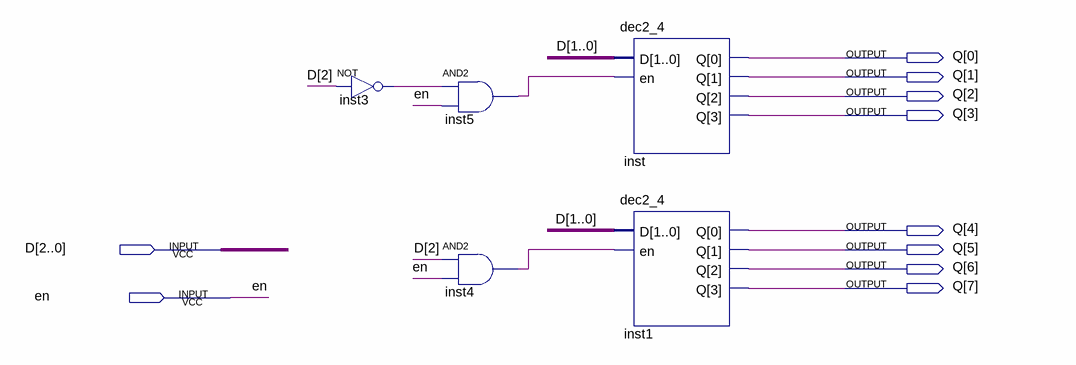
[diagram p0: schematic sheet]
// Quartus schematic dec3_8.bdf as structural Verilog: 5 symbols, 10 pins
module dec3_8 (
  input  [2:0] D,
  input  en,
  output [7:0] Q
);

  wire inst3_out, inst4_out, inst5_out;

  not inst3 (inst3_out, D[2]);
  and inst5 (inst5_out, inst3_out, en);
  and inst4 (inst4_out, D[2], en);
  dec2_4 inst (.D(D[1:0]), .en(inst5_out), .Q(Q[3:0]));
  dec2_4 inst1 (.D(D[1:0]), .en(inst4_out), .Q(Q[7:4]));
endmodule
